# Altium schematic sheet [06] LTE - A7670C.SchDoc
size A3; SheetNumber: 6; SheetTotal: 6
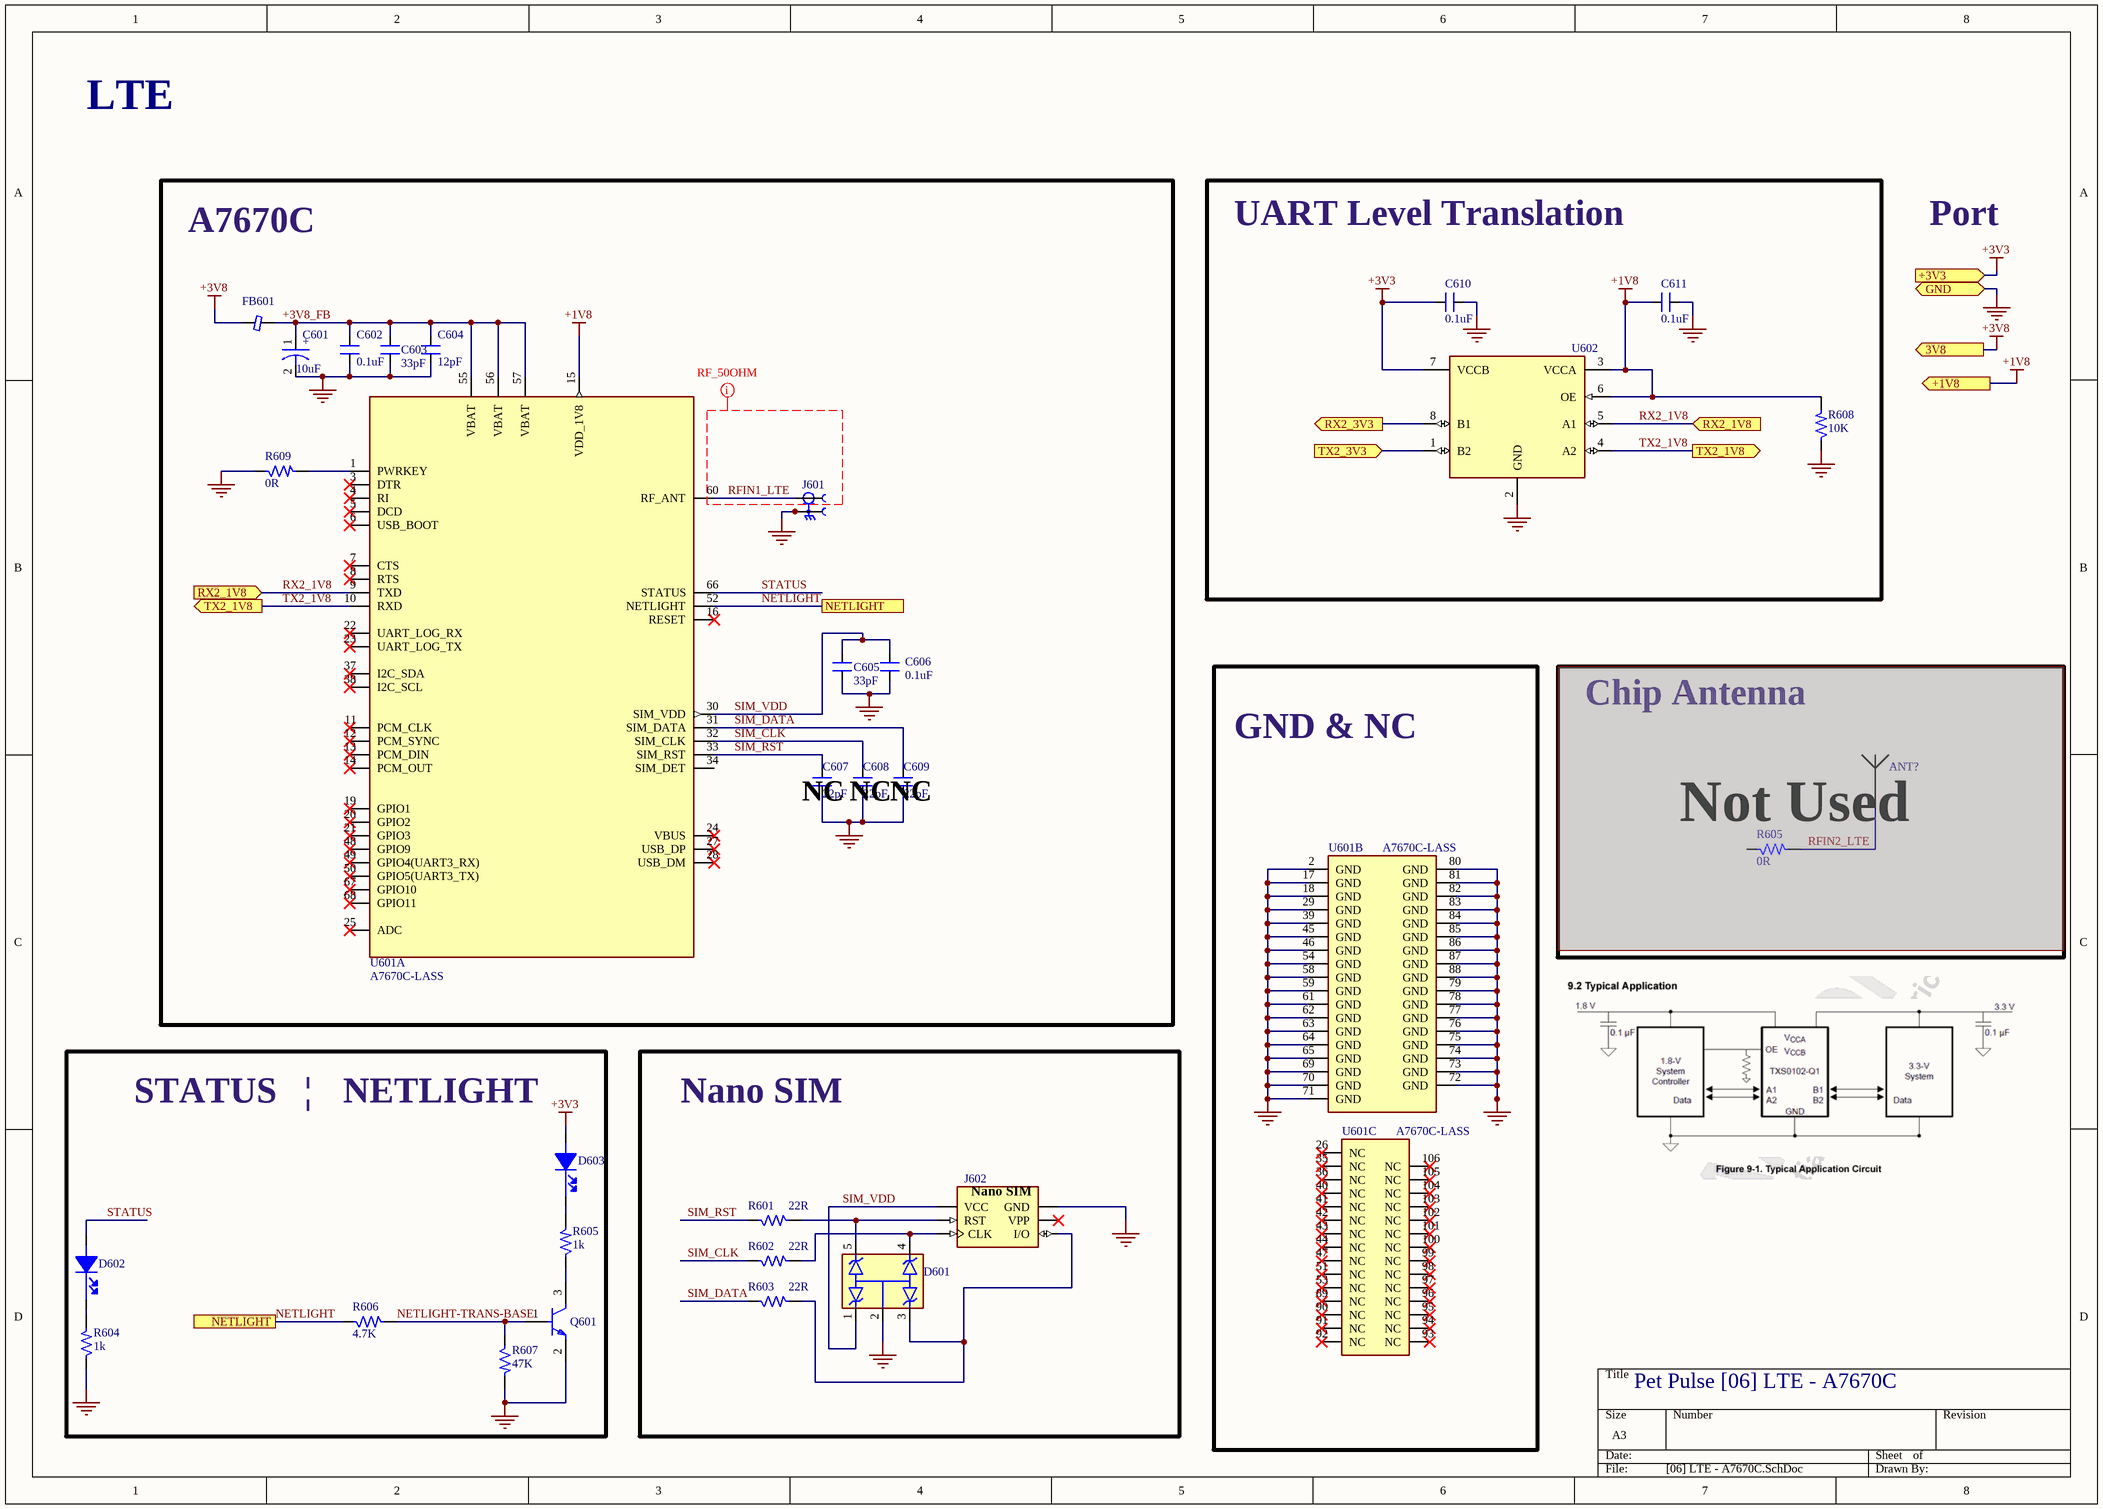
[diagram p0: [06] LTE - A7670C.SchDoc]

## Parts
(Parts that share a designator on the sheet are numbered #1, #2 ... from top to bottom, then left to right.)
ANT?  NN02-201  [ANT_Ignion_NN02-201]  (value not drawn)  (masked out: inside a compile mask, not in the netlist)
C601  10uF  [CAP-T_1206]
C602  0.1uF  [CAP_0805]
C603  33pF  [CAP_0805]
C604  12pF  [CAP_0805]
C605  33pF  [CAP_0805]
C606  0.1uF  [CAP_0805]
C607  22pF  [CAP_0805]
C608  22pF  [CAP_0805]
C609  22pF  [CAP_0805]
C610  0.1uF  [CAP_0805]
C611  0.1uF  [CAP_0805]
D601  ESDA6V1W5  [SOT-323-5]  (value not drawn)
D602  LED 0805 ORANGE  [LED_0805]  (value not drawn)
D603  LED 0805 ORANGE  [LED_0805]  (value not drawn)
FB601  MPZ2012S221AT000  [FB_0805]  (value not drawn)
J601  CON_UFL-SMD-T  [CON-UFL-SMD-T]  (value not drawn)
J602  SIM8051-6-0-14-01-A  [GCT_SIM8051-6-0-14-01-X-REVD]  (value not drawn)
Q601  MMBT3904-7-F  [FP-SOT23-MFG]  (value not drawn)
R601  22R  [RES_0805]
R602  22R  [RES_0805]
R603  22R  [RES_0805]
R604  1k  [RES_0805]
R605#1  0R  [RES_0603]  (masked out: inside a compile mask, not in the netlist)
R605#2  1k  [RES_0805]
R606  4.7K  [RES_0805]
R607  47K  [RES_0805]
R608  10K  [RES_0805]
R609  0R  [RES_0603]
U601  A7670C-LASS  [LTE_CHIP_A7670C-LASS]  (parts A,B,C of 3)
U602  TXS0102DCTR  [SOP65P400X130-8N]  (value not drawn)

## Blocks framed on the sheet
A7670C: C601-C609 FB601 J601 R609 U601
UART Level Translation: C610 C611 R608 U602
GND & NC: U601
Not Used: ANT? R605#1
Nano SIM: D601 J602 R601-R603

## Ports
3V8 (out, see [02] LDO and LiPo Circuit[4A], [05] External Modules[4A]), +1V8 (out, see [05] External Modules[4A]), +3V3 (in, see [02] LDO and LiPo Circuit[4A], [03] ESP32[2C], [04] GPS[4A], [05] External Modules[4A]), GND (bidir, see [02] LDO and LiPo Circuit[4A], [03] ESP32[2C], [04] GPS[4A], [05] External Modules[4A]), NETLIGHT (see [06] LTE - A7670C[1D]), NETLIGHT (see [06] LTE - A7670C[4B]), RX2_1V8 (in, see [06] LTE - A7670C[1B]), RX2_1V8 (in, see [06] LTE - A7670C[7B]), RX2_3V3 (out, see [03] ESP32[4B]), TX2_1V8 (out, see [06] LTE - A7670C[1B]), TX2_1V8 (out, see [06] LTE - A7670C[7B]), TX2_3V3 (in, see [03] ESP32[4B])

## Nets
+1V8: C611.2 R608.2 U601.15(VDD_1V8) U602.3(VCCA) U602.6(OE) ; port +1V8
+3V3: C610.2 D603.2(Anode) U602.7(VCCB) ; port +3V3
+3V8: FB601.1 ; port 3V8
GND: C601.2 C602.1 C603.1 C604.1 C605.1 C606.1 C607.1 C608.1 C609.1 C610.1 C611.1 D601.2 J601.2 J601.3 J602.C5(GND) Q601.2(E) R604.1 R607.2 R608.1 R609.1 U601.2(GND) U601.17(GND) U601.18(GND) U601.29(GND) U601.39(GND) U601.45(GND) U601.46(GND) U601.54(GND) U601.58(GND) U601.59(GND) U601.61(GND) U601.62(GND) U601.63(GND) U601.64(GND) U601.65(GND) U601.69(GND) U601.70(GND) U601.71(GND) U601.72(GND) U601.73(GND) U601.74(GND) U601.75(GND) U601.76(GND) U601.77(GND) U601.78(GND) U601.79(GND) U601.80(GND) U601.81(GND) U601.82(GND) U601.83(GND) U601.84(GND) U601.85(GND) U601.86(GND) U601.87(GND) U601.88(GND) U602.2(GND) ; port GND
+3V8_FB: C601.1 C602.2 C603.2 C604.2 FB601.2 U601.55(VBAT) U601.56(VBAT) U601.57(VBAT)
NETLIGHT: R606.1 U601.52(NETLIGHT) ; port NETLIGHT
NETLIGHT-TRANS-BASE: Q601.1(B) R606.2 R607.1
RFIN1_LTE: J601.1 U601.60(RF_ANT)
RX2_1V8: U601.9(TXD) U602.5(A1) ; port RX2_1V8
RX2_3V3: U602.8(B1) ; port RX2_3V3
SIM_CLK: C608.2 R602.1 U601.32(SIM_CLK)
SIM_DATA: C609.2 R603.1 U601.31(SIM_DATA)
SIM_RST: C607.2 R601.1 U601.33(SIM_RST)
SIM_VDD: C605.2 C606.2 D601.1 J602.C1(VCC) U601.30(SIM_VDD)
STATUS: D602.2(Anode) U601.66(STATUS)
TX2_1V8: U601.10(RXD) U602.4(A2) ; port TX2_1V8
TX2_3V3: U602.1(B2) ; port TX2_3V3
NetD601_3: D601.3 J602.C7(I/O) R603.2
NetD601_4: D601.4 J602.C3(CLK) R602.2
NetD601_5: D601.5 J602.C2(RST) R601.2
NetD602_1: D602.1(Cathode) R604.2
NetD603_1: D603.1(Cathode) R605#2.2
NetQ601_3: Q601.3(C) R605#2.1
NetR609_2: R609.2 U601.1(PWRKEY)

Not connected (* = marked no-connect by the designer): J602 C6(VPP)*; U601 3(DTR)* 4(RI)* 5(DCD)* 6(USB_BOOT)* 7(CTS)* 8(RTS)* 11(PCM_CLK)* 12(PCM_SYNC)* 13(PCM_DIN)* 14(PCM_OUT)* 16(RESET)* 19(GPIO1)* 20(GPIO2)* 21(GPIO3)* 22(UART_LOG_RX)* 23(UART_LOG_TX)* 24(VBUS)* 25(ADC)* 26(NC)* 27(USB_DP)* 28(USB_DM)* 34(SIM_DET) 35(NC)* 36(NC)* 37(I2C_SDA)* 38(I2C_SCL)* 40(NC)* 41(NC)* 42(NC)* 43(NC)* 44(NC)* 47(NC)* 48(GPIO9)* 49(GPIO4(UART3_RX))* 50(GPIO5(UART3_TX))* 51(NC)* 53(NC)* 67(GPIO10)* 68(GPIO11)* 89(NC)* 90(NC)* 91(NC)* 92(NC)* 93(NC)* 94(NC)* 95(NC)* 96(NC)* 97(NC)* 98(NC)* 99(NC)* 100(NC)* 101(NC)* 102(NC)* 103(NC)* 104(NC)* 105(NC)* 106(NC)*

## Layout directives
net class RF_50: RFIN1_LTE

## Notes on the sheet
- LTE
- Port
- Chip Antenna
- (near C607) NC
- (near C608) NC
- (near C609) NC
- STATUS   |
- NETLIGHT
- Pet Pulse [06] LTE - A7670C
- (in symbol CAP-P_10uF-16V-10%-1206) +
- (in symbol CON_NanoSIM_6Pin_SIM8051-6-0-14-01-A) Nano SIM

## Library data of the parts
ANT? = ANT-CHIP_Cellular_UltraWideBand_Ignion_NN02-201: ONE MXTEND MULTIBAND ANTENNA; Manufacturer: Ignion; Manufacturer Part Number: NN02-201; Case/Package: SMD
C601 = CAP-P_10uF-16V-10%-1206: 10µF Molded Tantalum Capacitors 16V 1206 (3216 Metric) 3Ohm; Manufacturer: AVX Corporation; Manufacturer Part Number: TAJA106K016SNJ; Alternate Part Number-1: CA45-A016K106T; Case/Package: 1206; Supplier-1: SIRICOM; Supplier Part Number-1: TAJA106K016SNJ
C602 C606 C610 C611 = CAP_0.1uF-50V-10%-0805: 0.1µF ±10% 50V Ceramic Capacitor X7R 0805 (2012 Metric); Manufacturer: Samsung; Manufacturer Part Number: CL21B104KBCNNNC; Alternate Part Number-1: NA; Case/Package: 0805; Supplier-1: SIRICOM; Supplier Part Number-1: 0805B104K500CT
C603 C605 = CAP_33pF-50V-5%-0805: 33pF ±5% 50V Ceramic Capacitor C0G/NPO 0805 (2012 Metric); Manufacturer: YAGEO; Manufacturer Part Number: CC0805JRNPO9BN330; Alternate Part Number-1: NA; Case/Package: 0805
C604 = CAP_12pF-50V-5%-0805: 12pF ±5% 50V Ceramic Capacitor C0G, NP0 0805 (2012 Metric); Manufacturer: KEMET; Manufacturer Part Number: CC0805JRNPO9BN120; Alternate Part Number-1: NA; Case/Package: 0805; Supplier-1: SIRICOM; Supplier Part Number-1: 0805N120J500CT
C607-C609 = CAP_22PF-50V-5%-0805: 22pF ±5% 50V Ceramic Capacitor C0G, NP0 0805 (2012 Metric); Manufacturer: Yageo; Manufacturer Part Number: CC0805JRNPO9BN220; Alternate Part Number-1: 0805CG220J500NT; Case/Package: 0805; Supplier-1: SIRICOM; Supplier Part Number-1: 0805N220J500CT
D601 = DIO_TVS_ARRY_3Vrm_6.1Vbr_ESDA6V1W5: Tvs Diode Array 3V reverse standoff, 6.1V reverse breakdown.  SOT-323-5; Manufacturer: STMicroelectronics; Manufacturer Part Number: ESDA6V1W5; Case/Package: SOT-323-5
D602 D603 = LED_ORANGE-2V-20mA- 0805: Orange LED 0805 Vf = 2V, 20mA; Manufacturer: Osram Opto; Manufacturer Part Number: LOR976-PS-1; Lens Color: White; Viewing Angle: 160°; Lens Style: Flat,Rectangular,Diffused,Colorless; Forward Current: 25mA; Luminous Intensity: 162.5mcd; Dominant Wavelength: 606nm; Luminous Flux: 0.735lm; Reverse Voltage: 12V; Lens Transparency: Diffused; Number of LEDs: 1; Lens Size: 1.25mm; Supplier 1: Arrow Electronics; RoHS: Yes; Category: LEDs; Stock 1: 2418; Pricing 1: 1=0.27100, 10=0.15400, 25=0.15270, 100=0.07290, 250=0.07210, 500=0.06600, 1000=0.05150 (USD); Mount: Surface Mount; Case/Package: 0805; Number of Pins: 2; Color: Orange; Case Code (Metric): 2012; Case Code (Imperial): 0805; Contact Plating: Tin,Matte; Min Operating Temperature: -30°C; Max Operating Temperature: 85°C; Packaging: Tape and Reel; Forward Voltage: 2V; Test Current: 20mA; Package Quantity: 16000; Illumination Color: Orange; Series: CHIPLED 0805; Length: 2mm; Width: 1.25mm; Height: 0.9mm; Radiation Hardening: No; RoHS Compliant: Yes; ComponentLink1URL: https://datasheet.ciiva.com/2119/00078881-0-2119287.pdf?src-supplier=Digi-Key; ComponentLink1Description: https://datasheet.ciiva.com/2119/00078881-0-2119287.pdf?src-supplier=Digi-Key; ComponentLink2URL: https://datasheet.ciiva.com/2119/00078881-0-2119286.pdf?src-supplier=Digi-Key; ComponentLink2Description: https://datasheet.ciiva.com/2119/00078881-0-2119286.pdf?src-supplier=Digi-Key; ComponentLink3URL: https://datasheet.ciiva.com/2119/00078881-0-2119288.pdf?src-supplier=Digi-Key; ComponentLink3Description: https://datasheet.ciiva.com/2119/00078881-0-2119288.pdf?src-supplier=Digi-Key; Supplier Part Number 1: LO R976-PS-1
FB601 = FB_220 OHM-100Mhz_3A_0805_MPZ2012S221AT000: Ferrite bead 220 Ohms @ 100 MHz 0805 (2012 Metric) 3A 40mOhm; Manufacturer: TDK Corporation; Manufacturer Part Number: MPZ2012S221AT000; Case/Package: 0805
J601 = CON_UFL-SMD-T: U.FL (UMCC) Connector Jack, Male Pin 50Ohm Surface Mount Solder; MP: CONUFL001-SMD-T; MF: Linx; Price: None; Package: None; Value: *; Check_prices: https://www.snapeda.com/parts/CONUFL001-SMD-T/Linx/view-part/?ref=eda; Availability: Unavailable; SnapEDA_Link: https://www.snapeda.com/parts/CONUFL001-SMD-T/Linx/view-part/?ref=snap
J602 = CON_NanoSIM_6Pin_SIM8051-6-0-14-01-A: 6 Position Card Connector NANO SIM Surface Mount, Right Angle Gold; Manufacturer: GCT; Manufacturer Part Number: SIM8051-6-0-14-01-A; Case/Package: SMT
Q601 = TRANS_NPN_MMBT3904: TRANS NPN 40V 0.2A SMD SOT23-3; Manufacturer: Diodes Incorporated; Frequency: 300MHz; Power Dissipation: 350mW; Element Configuration: Single; Max Power Dissipation: 300mW; Max Collector Current: 200mA; Collector Emitter Saturation Voltage: 300mV; Number of Elements: 1; hFE Min: 100; Collector Base Voltage (VCBO): 60V; Emitter Base Voltage (VEBO): 6V; Contact Plating: Tin; Package Quantity: 3000; Max Frequency: 300MHz; REACH SVHC: No SVHC; Max Operating Temperature: 150°C; Width: 1.4mm; Collector Emitter Voltage (VCEO): 40V; Voltage Rating (DC): 40V; Radiation Hardening: No; Case/Package: SOT-23; Height: 1mm; Collector Emitter Breakdown Voltage: 40V; Length: 3.05mm; Polarity: NPN; Packaging: Tape and Reel; Number of Pins: 3; Min Operating Temperature: -55°C; Gain Bandwidth Product: 300MHz; Mount: Surface Mount; Weight: 0.000282oz; Continuous Collector Current: 200mA; Transition Frequency: 300MHz; Max Breakdown Voltage: 40V; Lead Free: Lead Free; Manufacturer Part Number: MMBT3904-7-F
R601-R603 = RES_22R-0.125W-5%-0805: 22 Ohms ±5% 0.125W, 1/8W Chip Resistor 0805 (2012 Metric) Moisture Resistant Thick Film; Manufacturer: Stackpole Electronics; Manufacturer Part Number: RC0805JR-0722RL; Alternate Part Number-1: NA; Case/Package: 0805; Supplier-1: SIRICOM; Supplier Part Number-1: WR08X30R0FTL
R604 R605#2 = RES_1K- 0.125W-5%-0805: RES 1K OHM 5% 1/8W 0805; Manufacturer Part Number: RC0805JR-131KL; Manufacturer: YAGEO; Alternate Part Number: NA; Case/Package: 0805
R605#1 R609 = RES_0R-0.1W-0603: 0 Ohms 0603 (1608 Metric); Manufacturer: Stackpole Electronics Inc; Manufacturer Part Number: RMCF0603ZT0R00; Alternate Part Number-1: NA; Case/Package: 0603; Supplier-1: Digi-Key; Supplier Part Number-1: RMCF0603ZT0R00CT-ND
R606 = RES_4.7K-0.125W-1%-0805: 4.7 kOhms ±1% 0.125W, 1/8W Chip Resistor 0805 (2012 Metric) Moisture Resistant Thick Film; Manufacturer: YAGEO; Manufacturer Part Number: RC0805FR-074K7L; Case/Package: 0805
R607 = RES_47K-0.125W-1%-0805: 47 kOhms ±1% 0.125W, 1/8W Chip Resistor 0805 (2012 Metric) Moisture Resistant Thick Film; Manufacturer: YAGEO; Manufacturer Part Number: RC0805FR-0747KL; Case/Package: 0805
R608 = RES_10K-0.125W-1%-0805: 10 kOhms ±1% 0.125W, 1/8W Chip Resistor 0805 (2012 Metric) Automotive AEC-Q200 Thick Film; Manufacturer: CTS; Manufacturer Part Number: WR08X1002FTL; Case/Package: 0805; Supplier-1: SIRICOM; Supplier Part Number-1: WR08X1002FTL; Alternate Part Number-1: WR08X1002FTL
U601 = MOD_LTE_CHIP_A7670C-LASS: Manufacturer: SimCom; Manufacturer Part Number: Self-Procurred
U602 = IC_LEV-TRANS-2BIT_TXS0102DCTR: 2-Bit Bidirectional Voltage-Level Shifter for Open-Drain and Push-Pull Application 8-SM8 -40 to 85; MF: Texas Instruments; Value: *; Price: None; Package: SSOP-8 Texas Instruments; SnapEDA_Link: https://www.snapeda.com/parts/TXS0102DCTR/Texas%20Instruments/view-part/46770/?ref=snap; Availability: Unavailable; Texas_Instruments-Purchase-URL: https://snapeda.com/shop?store=Texas+Instruments&id=46770; MP: TXS0102DCTR; Manufacturer: Texas Instruments; Manufacturer Part Number: TXS0102DCTR; Case/Package: SM8